# Altium schematic sheet Drive_X.SchDoc
size A4; Organization: Altium Limited; Address1: L3, 12a Rodborough Rd; Address2: Frenchs Forest; Address3: NSW; Address4: Australia 2086
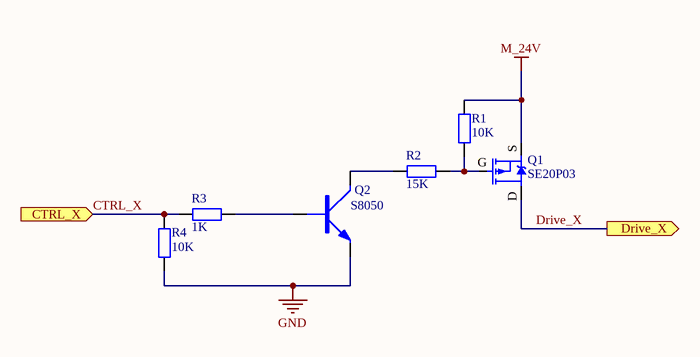
[diagram p0: Drive_X.SchDoc]

## Parts
Q1  SE20P03  [TO252]
Q2  S8050  [SOT-23]
R1  10K  [R 0603]
R2  15K  [R 0603]
R3  1K  [R 0603]
R4  10K  [R 0603]

## Ports
CTRL_X (in), Drive_X (out)

## Nets
GND: Q2.E R4.2
M_24V: Q1.S R1.2
CTRL_X: R3.1 R4.1 ; port CTRL_X
Drive_X: Q1.D ; port Drive_X
NetQ1_G: Q1.G R1.1 R2.1
NetQ2_B: Q2.B R3.2
NetQ2_C: Q2.C R2.2

## Notes on the sheet
- Title
- Size:
- Date:
- A4
- Number:
- Time:
- Revision:
- Sheet
- of
- File:

## Library data of the parts
Q1 = P-MOS: P沟道场效应管
Q2 = NPN: NPN三极管
R1-R4 = R: 贴片电阻; 版权归属: 源创客; BOM名称: 贴片电阻; 学习资源: www.ooocke.com